# Altium schematic sheet qi_adapter.SchDoc
size A4
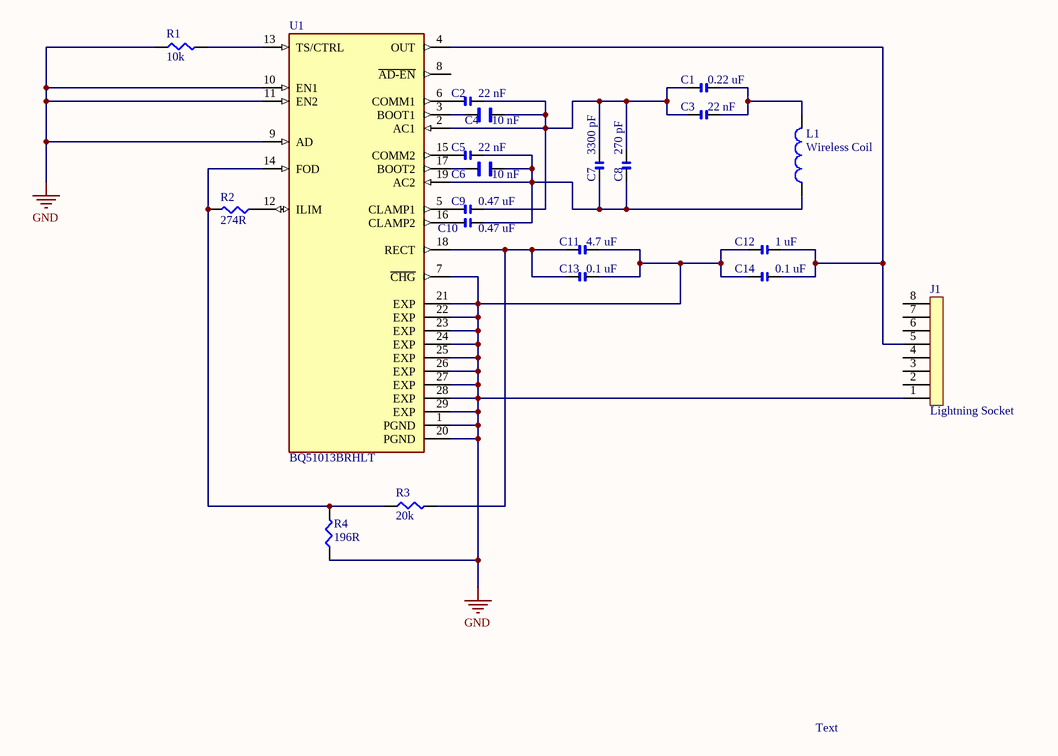
[diagram p0: qi_adapter.SchDoc]

## Parts
C1  0.22 uF  [SMD-0402-CAP]
C2  22 nF  [SMD-0402-CAP]
C3  22 nF  [SMD-0402-CAP]
C4  10 nF  [SMD-0402-CAP]
C5  22 nF  [SMD-0402-CAP]
C6  10 nF  [SMD-0402-CAP]
C7  3300 pF  [SMD-0402-CAP]
C8  270 pF  [SMD-0402-CAP]
C9  0.47 uF  [SMD-0402-CAP]
C10  0.47 uF  [SMD-0402-CAP]
C11  4.7 uF  [SMD-0402-CAP]
C12  1 uF  [SMD-0402-CAP]
C13  0.1 uF  [SMD-0402-CAP]
C14  0.1 uF  [SMD-0402-CAP]
J1  Lightning Socket  [Lightning Connector]
L1  Wireless Coil  [Qi Coil]
R1  10k  [SMD-0402-RES]
R2  274R  [SMD-0402-RES]
R3  20k  [SMD-0402-RES]
R4  196R  [SMD-0402-RES]
U1  BQ51013BRHLT  [IC_BQ51013BRHLT]

## Nets
GND: C11.1 C12.2 C13.1 C14.2 J1.1(GND) R1.1 R4.2 U1.1(PGND) U1.7(~{CHG}) U1.9(AD) U1.10(EN1) U1.11(EN2) U1.20(PGND) U1.21(EXP) U1.22(EXP) U1.23(EXP) U1.24(EXP) U1.25(EXP) U1.26(EXP) U1.27(EXP) U1.28(EXP) U1.29(EXP)
NetC1_1: C1.1 C3.1 L1.1
NetC1_2: C1.2 C2.1 C3.2 C4.1 C7.1 C8.1 C9.1 U1.2(AC1)
NetC2_2: C2.2 U1.6(COMM1)
NetC4_2: C4.2 U1.3(BOOT1)
NetC5_1: C5.1 C6.1 C7.2 C8.2 C10.1 L1.2 U1.19(AC2)
NetC5_2: C5.2 U1.15(COMM2)
NetC6_2: C6.2 U1.17(BOOT2)
NetC9_2: C9.2 U1.5(CLAMP1)
NetC10_2: C10.2 U1.16(CLAMP2)
NetC11_2: C11.2 C13.2 R3.2 U1.18(RECT)
NetC12_1: C12.1 C14.1 J1.5(Vcc) U1.4(OUT)
NetR1_2: R1.2 U1.13(TS/CTRL)
NetR2_1: R2.1 U1.12(ILIM)
NetR2_2: R2.2 R3.1 R4.1 U1.14(FOD)

Not connected (* = marked no-connect by the designer): J1 2(L0+) 3(L0-) 4(ID0) 6(L1-) 7(L1+) 8(ID1); U1 8(~{AD-EN})

## Notes on the sheet
- Text

## Library data of the parts
C1 = 0.22 uF 0402: 0.22µF ±10% 25V Ceramic Capacitor X5R 0402; MF: Murata Electronics; MP: GRT155R61E224KE01D; Digikey Part: 490-12265-1-ND; Link: https://www.digikey.ca/product-detail/en/murata-electronics/GRT155R61E224KE01D/490-12265-1-ND/5416966; Availability: Available; Package: 0402; Price: 0.16; Value: 0.22 uF
C2 C3 C5 = 22nF 0402: 0.022µF -20%, +80% 25V Ceramic Capacitor Y5V (F) 0402; MF: Yageo; MP: CC0402ZRY5V8BB223; Digikey Part: 311-3823-1-ND; Link: https://www.digikey.ca/product-detail/en/yageo/CC0402ZRY5V8BB223/311-3823-1-ND/8024912; Availability: Available; Package: 0402; Price: 0.16; Value: 22 nF
C4 C6 = 10nF 0402: 10000pF ±10% 25V Ceramic Capacitor X7R 0402; MF: KEMET; MP: C0402C103K3RACTU; Digikey Part: 399-1278-1-ND; Link: https://www.digikey.ca/product-detail/en/kemet/C0402C103K3RACTU/399-1278-1-ND/416054; Availability: Available; Package: 0402; Price: 0.16; Value: 10 nF
C7 = 3300 pF 0402: 3300pF ±10% 25V Ceramic Capacitor X7R 0402; MF: Würth Elektronik; MP: 885012205047; Digikey Part: 732-7542-1-ND; Link: https://www.digikey.ca/product-detail/en/w%C3%BCrth-elektronik/885012205047/732-7542-1-ND/5454169; Availability: Available; Package: 0402; Price: 0.16; Value: 3300 pF
C8 = 270 pF 0402: 270pF ±5% 25V Ceramic Capacitor C0G, NP0 040; MF: KEMET; MP: C0402C271J3GAC7867; Digikey Part: 399-15315-1-ND; Link: https://www.digikey.ca/product-detail/en/kemet/C0402C271J3GAC7867/399-15315-1-ND/7386713; Availability: Available; Package: 0402; Price: 0.16; Value: 270 pF
C9 C10 = 0.47uF 0402: 0.47µF ±10% 25V Ceramic Capacitor X5R 0402; MF: Murata Electronics; MP: GRT155R61E474KE01D; Digikey Part: 490-12269-1-ND; Link: https://www.digikey.ca/product-detail/en/murata-electronics/GRT155R61E474KE01D/490-12269-1-ND/5416970; Availability: Available; Package: 0402; Price: 0.19; Value: 0.47 uF
C11 = 4.7uF 0402: 4.7µF ±20% 16V Ceramic Capacitor X5R 0402; MF: AVX Corporation; MP: 0402YD475MAT2A; Digikey Part: 478-10788-1-ND; Link: https://www.digikey.ca/product-detail/en/avx-corporation/0402YD475MAT2A/478-10788-1-ND/7536324; Availability: Available; Package: 0402; Price: 0.52; Value: 4.7 uF
C12 = 1uF 0402: 1µF ±10% 16V Ceramic Capacitor X5R 0402; MF: Samsung Electro-Mechanics; MP: CL05A105KO5NNNC; Digikey Part: 1276-1067-1-ND; Link: https://www.digikey.ca/product-detail/en/samsung-electro-mechanics/CL05A105KO5NNNC/1276-1067-1-ND/3889153; Availability: Available; Package: 0402; Price: 0.16; Value: 1 uF
C13 C14 = 0.1uF 0402: 0.1µF -20%, +80% 16V Ceramic Capacitor Y5V (F) 0402; MF: Samsung Electro-Mechanics; MP: CL05F104ZO5NNNC; Digikey Part: 1276-1004-1-ND; Link: https://www.digikey.ca/product-detail/en/samsung-electro-mechanics/CL05F104ZO5NNNC/1276-1004-1-ND/3889090; Availability: Available; Package: 0402; Price: 0.16; Value: 0.1 uF
J1 = Lightning Socket: Female Lightning Socket
L1 = Wireless Coil: Qi Compatible Wireless Receiver Coil; ComponentLink1Description: Digikey Link; ComponentLink1URL: https://www.digikey.ca/products/en/inductors-coils-chokes/wireless-charging-coils/75?k=wireless+coil&k=&pkeyword=wireless+coil&sv=0&pv46=15578&sf=1&FV=-8%7C75&quantity=&ColumnSort=0&page=1&pageSize=25
R1 = 10K 0402: 10 kOhms ±5% 0.063W, 1/16W Chip Resistor 0402 Moisture Resistant Thick Film; Part Number: RC0402JR-0710KL; Manufacturer: Yageo; Digi-Key Part Number: 311-10KJRCT-ND; Price: 0.17; Tolerance: ±5%; Package / Case: 0402; Supplier Device Package: 0402; Link: https://www.digikey.ca/product-detail/en/yageo/RC0402JR-0710KL/311-10KJRCT-ND/729365
R2 = 274R 0402: 274 Ohms ±1% 0.1W, 1/10W Chip Resistor 0402; Part Number: ERJ-2RKF2740X; Manufacturer: Panasonic Electronic Components; Digi-Key Part Number: P274LCT-ND; Price: .16; Tolerance: ±1%; Package / Case: 0402; Supplier Device Package: 0402; Link: https://www.digikey.ca/product-detail/en/panasonic-electronic-components/ERJ-2RKF2740X/P274LCT-ND/194305
R3 = 20K 0402: 20 kOhms ±1% 0.1W, 1/10W Chip Resistor 0402; Part Number: ERJ-2RKF2002X; Manufacturer: Panasonic Electronic Components; Digi-Key Part Number: P20.0KLCT-ND; Price: .16; Tolerance: ±1%; Package / Case: 0402; Supplier Device Package: 0402; Link: https://www.digikey.ca/product-detail/en/panasonic-electronic-components/ERJ-2RKF2002X/P20-0KLCT-ND/194250
R4 = 196R 0402: 196 Ohms ±1% 0.1W, 1/10W Chip Resistor 0402; Part Number: ERJ-2RKF1960X; Manufacturer: Panasonic Electronic Components; Digi-Key Part Number: P196LCT-ND; Price: .16; Tolerance: ±1%; Package / Case: 0402; Supplier Device Package: 0402; Link: https://www.digikey.ca/product-detail/en/panasonic-electronic-components/ERJ-2RKF1960X/P196LCT-ND/194231
U1 = BQ51013BRHLT: Wireless Power Receiver PMIC 20-VQFN _3.5x4.5_; MF: Texas Instruments; Digi-Key_Part_Number: 296-35638-1-ND; SnapEDA_Link: https://www.snapeda.com/parts/BQ51013BRHLT/Texas%20Instruments/view-part/46178/?ref=snap; Value: *; Digi-Key_Purchase_URL: https://www.digikey.com/product-detail/en/texas-instruments/BQ51013BRHLT/296-35638-1-ND/3877679?utm_source=snapeda&utm_medium=aggregator&utm_campaign=symbol; Package: VQFN-20 Texas Instruments; MP: BQ51013BRHLT